# Altium schematic sheet Battery_management_system.schdoc
size A4; Organization: UFSC; DocumentNumber: 3; SheetNumber: 3; SheetTotal: 3
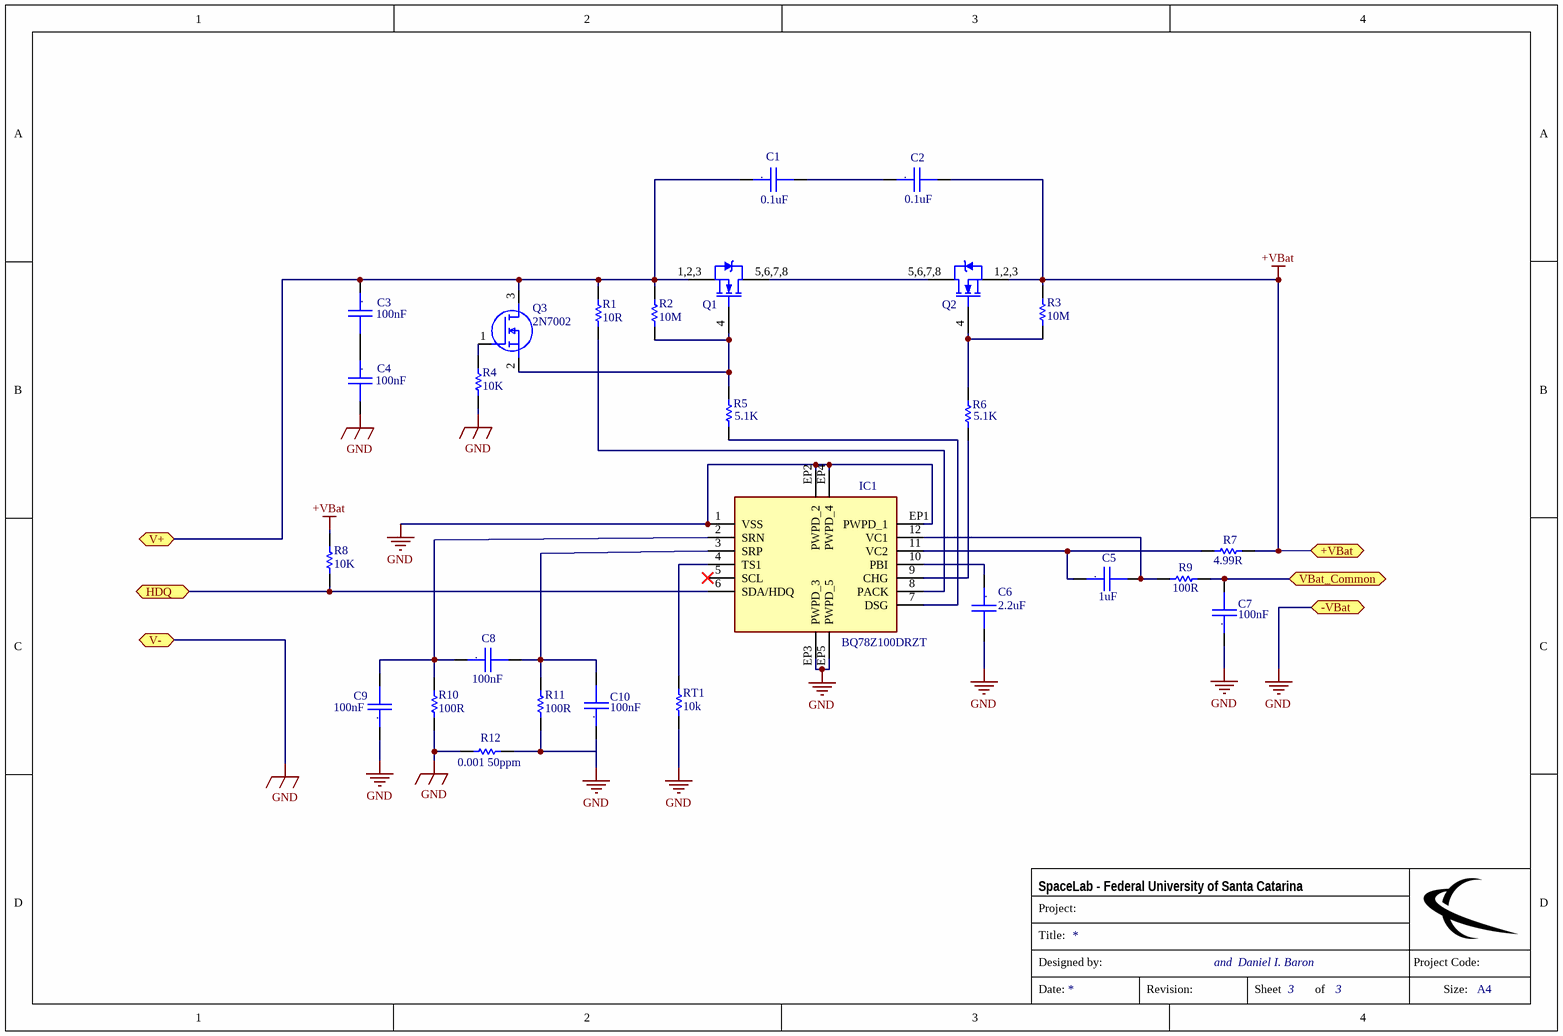
[diagram p0: Battery_management_system.schdoc]

## Parts
C1  0.1uF  [CC0603]
C2  0.1uF  [CC0603]
C3  Capacitance: 100nF  [CC0603]  (hidden comment: 0.1uF/50V)
C4  Capacitance: 100nF  [CC0603]  (hidden comment: 0.1uF/50V)
C5  Capacitance: 1uF  (hidden comment: CL10B105KO8VPNC)
C6  Capacitance: 2.2uF  [CC0603]  (hidden comment: CGA3E1X7S1C225K080AC)
C7  Capacitance: 100nF  [CC0603]  (hidden comment: CL10B104KO8WPNC)
C8  Capacitance: 100nF  [CC0603]  (hidden comment: CL10B104KO8WPNC)
C9  Capacitance: 100nF  [CC0603]  (hidden comment: CL10B104KO8WPNC)
C10  Capacitance: 100nF  [CC0603]  (hidden comment: CL10B104KO8WPNC)
IC1  BQ78Z100DRZT  [BQ78Z100DRZT]
Q1  CSD16412Q5A  [Q5A]  (value not drawn)
Q2  CSD16412Q5A  [Q5A]  (value not drawn)
Q3  2N7002  [SOT96P240X120-3N]
R1  Resistance: 10R  [0603]  (hidden comment: CRCW060310R0FKEA)
R2  value 10M  [0603]  (hidden comment: MCT06030C1005FP500)
R3  value 10M  [0603]  (hidden comment: MCT06030C1005FP500)
R4  value 10K  [0603]  (hidden comment: MCT0603MC1002FP50)
R5  value 5.1K  [0603]  (hidden comment: MCT06030C5101FP500)
R6  value 5.1K  [0603]  (hidden comment: MCT06030C5101FP500)
R7  Resistance: 4.99R  [0603]  (hidden comment: CRCW04024R99FKED)
R8  value 10K  [0603]  (hidden comment: MCT0603MC1002FP50)
R9  value 100R  [0603]  (hidden comment: MCT06030C1000FP500)
R10  value 100R  [0603]  (hidden comment: MCT06030C1000FP500)
R11  value 100R  [0603]  (hidden comment: MCT06030C1000FP500)
R12  value 0.001 50ppm  (hidden comment: CSNL1206FT1L00)
RT1  10k  [SEMI-103AT-2_V]

## Ports
+VBat (bidir), -VBat (bidir), HDQ (bidir), V+ (bidir), V- (bidir), VBat_Common (bidir)

## Nets
+VBat: C2.2 Q2.1,2,3(S) R3.2 R7.2 R8.2 ; port +VBat
GND: C4.2 C6.2 C7.1 C9.1 C10.1 IC1.1(VSS) IC1.EP1(PWPD_1) IC1.EP2(PWPD_2) IC1.EP3(PWPD_3) IC1.EP4(PWPD_4) IC1.EP5(PWPD_5) R4.1 R10.1 R11.1 R12.1 R12.2 RT1.1 ; port -VBat, port V-
HDQ: IC1.6(SDA/HDQ) R8.1 ; port HDQ
V+: C1.1 C3.1 Q1.1,2,3(S) Q3.3(D) R1.1 R2.2 ; port V+
VBat_Common: C7.2 R9.1 ; port VBat_Common
NetC1_2: C1.2 C2.1
NetC3_2: C3.2 C4.1
NetC5_1: C5.1 IC1.11(VC2) R7.1
NetC5_2: C5.2 IC1.12(VC1) R9.2
NetC6_1: C6.1 IC1.10(PBI)
NetC8_1: C8.1 C9.2 IC1.2(SRN) R10.2
NetC8_2: C8.2 C10.2 IC1.3(SRP) R11.2
NetIC1_4: IC1.4(TS1) RT1.2
NetIC1_7: IC1.7(DSG) R5.1
NetIC1_8: IC1.8(PACK) R1.2
NetIC1_9: IC1.9(CHG) R6.1
NetQ1_4: Q1.4(G) Q3.2(S) R2.1 R5.2
NetQ1_5,6,7,8: Q1.5,6,7,8(D) Q2.5,6,7,8(D)
NetQ2_4: Q2.4(G) R3.1 R6.2
NetQ3_1: Q3.1(G) R4.2

Not connected (* = marked no-connect by the designer): IC1 5(SCL)*

## Notes on the sheet
- and  Daniel I. Baron
- Project:
- SpaceLab - Federal University of Santa Catarina
- Title:
- Designed by:
- Project Code:
- Date:
- Revision:
- Sheet
- of
- Size:
- A4
- (in symbol Cap_Cer_X7R_0.1uF_50V_0603) .
- (in symbol CGA3E1X7S1C225K080AC) .
- (in symbol CL10B104KO8WPNC) .
- (in symbol CL10B105KO8VPNC) .

## Library data of the parts
C1 C2 = Cap_Cer_X7R_0.1uF_50V_0603: CAP CER 0.1UF 50V 10% X7R 0603; Partnumber: CC0603KPX7R9BB104; Manufacturer: Yageo; Capacitance: 100nF; Supplier 1: Mouser; Supplier Part Number 1: 603-CC603KPX7R9BB104; Stock 1: 5712768; Pricing 1: 1=0.1, 10=0.065, 100=0.02, 1000=0.016, 2500=0.013, 10000=0.01 (USD); Mount: Surface Mount; Case/Package: 0603; Number of Pins: 2; Weight: 7.1E-05oz; Case Code (Imperial): 0603; Case Code (Metric): 1608; Min Operating Temperature: -55°C; Max Operating Temperature: 125°C; Tolerance: 10%; Dielectric: X7R; Packaging: Tape and Reel; Voltage Rating (DC): 50V; Voltage Rating: 50V; Termination: SMD/SMT; Composition: Ceramic; Length: 1.6mm; Height: 0.8mm; Width: 0.031inch; Thickness: 0.035inch; Depth: 0.8mm; Radiation Hardening: No; Lead Free: Lead Free; Halogen Free: Halogen Free; ComponentLink1URL: https://www.verical.com/server-webapp/html/getDatasheet?partID=653026&src-supplier=Verical; ComponentLink1Description: https://www.verical.com/server-webapp/html/getDatasheet?partID=653026&src-supplier=Verical; Supplier 2: Digi-Key; Supplier Part Number 2: 311-3567-1-ND; Stock 2: 0; Pricing 2: 1=0.1, 10=0.066, 50=0.036, 100=0.0293, 500=0.02094, 1000=0.01646, 2500=0.01496, 5000=0.01376 (USD); Manufacturer Part Number: CC0603KPX7R9BB104
C3 C4 = Cap_Cer_X7R_0.1uF_50V_0603: CAP CER 0.1UF 50V 10% X7R 0603; Partnumber: CC0603KPX7R9BB104; Manufacturer: Yageo; Supplier 1: Mouser; Supplier Part Number 1: 603-CC603KPX7R9BB104; Stock 1: 5712768; Pricing 1: 1=0.1, 10=0.065, 100=0.02, 1000=0.016, 2500=0.013, 10000=0.01 (USD); Mount: Surface Mount; Case/Package: 0603; Number of Pins: 2; Weight: 7.1E-05oz; Case Code (Imperial): 0603; Case Code (Metric): 1608; Min Operating Temperature: -55°C; Max Operating Temperature: 125°C; Tolerance: 10%; Dielectric: X7R; Packaging: Tape and Reel; Voltage Rating (DC): 50V; Voltage Rating: 50V; Termination: SMD/SMT; Composition: Ceramic; Length: 1.6mm; Height: 0.8mm; Width: 0.031inch; Thickness: 0.035inch; Depth: 0.8mm; Radiation Hardening: No; Lead Free: Lead Free; Halogen Free: Halogen Free; ComponentLink1URL: https://www.verical.com/server-webapp/html/getDatasheet?partID=653026&src-supplier=Verical; ComponentLink1Description: https://www.verical.com/server-webapp/html/getDatasheet?partID=653026&src-supplier=Verical; Supplier 2: Digi-Key; Supplier Part Number 2: 311-3567-1-ND; Stock 2: 0; Pricing 2: 1=0.1, 10=0.066, 50=0.036, 100=0.0293, 500=0.02094, 1000=0.01646, 2500=0.01496, 5000=0.01376 (USD); Manufacturer Part Number: CC0603KPX7R9BB104
C5 = CL10B105KO8VPNC: SMD Multilayer Ceramic Capacitor,1uF, 16 V, 0603 [1608 Metric], 10%, X7R, CL Series; Manufacturer: Samsung; Description: SAMSUNG ELECTRO-MECHANICS - CL10B105KO8VPNC - SMD Multilayer Ceramic Capacitor, 1 &#181;F, 16 V, 0603 [1608 Metric], &#177; 10%, X7R, CL Series; Voltage Rating: 16V; Supplier 1: Digi-Key; Manufacturer Part Number: CL10B105KO8VPNC; RoHS: Yes; Category: Ceramic Capacitors; Stock 1: 897530; Pricing 1: 1=0,18000, 10=0,12900, 50=0,07340, 100=0,06080, 500=0,04260, 1000=0,03527 (USD); Mount: Surface Mount; Case/Package: 0603; Case Code (Metric): 1608; Case Code (Imperial): 0603; Min Operating Temperature: -55°C; Max Operating Temperature: 125°C; Tolerance: 10%; Packaging: Tape and Reel; Dielectric: X7R; Features: Soft Termination; Length: 0.063inch; Width: 0.031inch; Thickness: 0.035inch; Depth: 0.8mm; Ratings: AEC-Q200; Lead Free: Lead Free; RoHS Compliant: Yes; ComponentLink1URL: http://www.farnell.com/datasheets/2710686.pdf?src-supplier=Farnell; ComponentLink1Description: http://www.farnell.com/datasheets/2710686.pdf?src-supplier=Farnell; ComponentLink2URL: http://www.samsungsem.com/servlet/FileDownload?type=spec&file=CL10B105KO8VPNC.pdf&src-supplier=Avnet; ComponentLink2Description: http://www.samsungsem.com/servlet/FileDownload?type=spec&file=CL10B105KO8VPNC.pdf&src-supplier=Avnet; ComponentLink3URL: http://www.samsungsem.com/kr/support/product-search/mlcc/CL10B105KO8VPNC.jsp?src-supplier=Digi-Key; ComponentLink3Description: http://www.samsungsem.com/kr/support/product-search/mlcc/CL10B105KO8VPNC.jsp?src-supplier=Digi-Key; ComponentLink4URL: http://www.farnell.com/datasheets/2710686.pdf?src-supplier=Newark; ComponentLink4Description: http://www.farnell.com/datasheets/2710686.pdf?src-supplier=Newark; ComponentLink5URL: http://www.farnell.com/datasheets/2710686.pdf?src-supplier=Element14; ComponentLink5Description: http://www.farnell.com/datasheets/2710686.pdf?src-supplier=Element14; ComponentLink6URL: http://components.arrow.com/part/dataview/0323_06933310?src-supplier=Arrow+Europe; ComponentLink6Description: http://components.arrow.com/part/dataview/0323_06933310?src-supplier=Arrow+Europe; Supplier Part Number 1: 1276-6613-1-ND
C6 = CGA3E1X7S1C225K080AC: CAP CER 2.2UF 16V X7S 0603; Manufacturer: TDK; Tolerance: 10%; Supplier 1: Digi-Key; Manufacturer Part Number: CGA3E1X7S1C225K080AC; RoHS: Yes; Category: Ceramic Capacitors; Stock 1: 29; Pricing 1: 1=0,27000, 10=0,18500, 50=0,12320, 100=0,10470, 500=0,07392, 1000=0,06468 (USD); Mount: Surface Mount; Case/Package: 0603; Case Code (Metric): 1608; Case Code (Imperial): 0603; Min Operating Temperature: -55°C; Max Operating Temperature: 125°C; Package Quantity: 1; Packaging: Cut Tape; Voltage Rating: 16V; Dielectric: X7S; Voltage Rating (DC): 16V; Length: 0.063inch; Width: 0.031inch; Thickness: 0.035inch; Ratings: AEC-Q200; REACH SVHC: No SVHC; Lead Free: Lead Free; RoHS Compliant: Yes; ComponentLink1URL: http://www.farnell.com/datasheets/2292075.pdf?src-supplier=Farnell; ComponentLink1Description: http://www.farnell.com/datasheets/2292075.pdf?src-supplier=Farnell; ComponentLink2URL: https://product.tdk.com/info/en/catalog/spec/mlccspec_automotive_general_midvoltage_en.pdf?src-supplier=Digi-Key; ComponentLink2Description: https://product.tdk.com/info/en/catalog/spec/mlccspec_automotive_general_midvoltage_en.pdf?src-supplier=Digi-Key; ComponentLink3URL: http://www.farnell.com/datasheets/1936565.pdf?src-supplier=Element14; ComponentLink3Description: http://www.farnell.com/datasheets/1936565.pdf?src-supplier=Element14; ComponentLink4URL: https://product.tdk.com/info/en/catalog/datasheets/mlcc_automotive_general_en.pdf?src-supplier=Digi-Key; ComponentLink4Description: https://product.tdk.com/info/en/catalog/datasheets/mlcc_automotive_general_en.pdf?src-supplier=Digi-Key; ComponentLink5URL: http://product.tdk.com/en/catalog/datasheets/mlcc_automotive_general_en.pdf?src-supplier=Avnet; ComponentLink5Description: http://product.tdk.com/en/catalog/datasheets/mlcc_automotive_general_en.pdf?src-supplier=Avnet; ComponentLink6URL: http://www.farnell.com/datasheets/2292075.pdf?src-supplier=Newark; ComponentLink6Description: http://www.farnell.com/datasheets/2292075.pdf?src-supplier=Newark; Supplier Part Number 1: 445-16104-1-ND
C7-C10 = CL10B104KO8WPNC: CAP CER 0.1UF 16V X7R 0603; Manufacturer: Samsung; Tolerance: 10%; Supplier 1: Digi-Key; Supplier Part Number 1: 1276-6582-1-ND; Manufacturer Part Number: CL10B104KO8WPNC; RoHS: No; Category: Ceramic Capacitors; Stock 1: 515701; Pricing 1: 1=0,10000, 10=0,04200, 50=0,02280, 100=0,01860, 500=0,01328, 1000=0,01044 (USD); Mount: Surface Mount; Case/Package: 0603; Case Code (Imperial): 0603; Case Code (Metric): 1608; Min Operating Temperature: -55°C; Max Operating Temperature: 125°C; Packaging: Tape and Reel; Voltage Rating: 16V; Features: Soft Termination; Length: 0.063inch; Width: 0.031inch; Thickness: 0.035inch; Ratings: AEC-Q200; ComponentLink1URL: http://www.samsungsem.com/servlet/FileDownload?filename=productcatalog/pdf/MLCC.pdf&src-supplier=Avnet; ComponentLink1Description: http://www.samsungsem.com/servlet/FileDownload?filename=productcatalog/pdf/MLCC.pdf&src-supplier=Avnet; ComponentLink2URL: http://www.samsungsem.com/kr/support/product-search/mlcc/CL10B104KO8WPNC.jsp?src-supplier=Digi-Key; ComponentLink2Description: http://www.samsungsem.com/kr/support/product-search/mlcc/CL10B104KO8WPNC.jsp?src-supplier=Digi-Key
IC1 = BQ78Z100DRZT: Integrated Circuit; Manufacturer_Name: Texas Instruments; Datasheet Link: http://www.ti.com/lit/gpn/BQ78Z100; Height: 0.9mm; Manufacturer_Part_Number: BQ78Z100DRZT; Mouser Part Number: 595-BQ78Z100DRZT; Mouser Price/Stock: https://www.mouser.co.uk/ProductDetail/Texas-Instruments/BQ78Z100DRZT?qs=OjC2D0sG%2F26pqtddZWniKw%3D%3D; Arrow Part Number: BQ78Z100DRZT; Arrow Price/Stock: https://www.arrow.com/en/products/bq78z100drzt/texas-instruments; Supplier 1: Digi-Key; Supplier Part Number 1: 296-42996-1-ND
Q1 Q2 = CSD16412Q5A: Trans MOSFET N-CH 25V 14A 8-Pin SON EP T/R; Manufacturer: Texas Instruments; Max Power Dissipation: 3W; Element Configuration: Single; Rds On Max: 11mR; Input Capacitance: 530pF; Rise Time: 7.1ns; Continuous Drain Current (ID): 52A; Fall Time: 3.3ns; Drain to Source Resistance: 9mR; Turn-Off Delay Time: 5.7ns; Gate to Source Voltage (Vgs): 16V; Turn-On Delay Time: 5.5ns; Number of Elements: 1; Polarity: N-CHANNEL; Nominal Vgs: 2V; Supplier 1: Digi-Key; Manufacturer Part Number: CSD16412Q5A; RoHS: Yes; Category: MOSFETs; Stock 1: 1817; Pricing 1: 1=1,00000, 10=0,86500, 25=0,82520, 100=0,59900, 500=0,50046, 1000=0,42592 (USD); Mount: Surface Mount; Case/Package: SON; Number of Pins: 8; Contact Plating: Tin,Matte; Min Operating Temperature: -55°C; Max Operating Temperature: 150°C; Package Quantity: 1; Packaging: Tape and Reel; Series: NexFET™; Power Dissipation: 3W; Drain to Source Voltage (Vdss): 25V; Drain to Source Breakdown Voltage: 25V; Dual Supply Voltage: 25V; Threshold Voltage: 2V; Termination: SMD/SMT; Length: 5.8mm; Width: 5mm; Height: 1.1mm; Radiation Hardening: No; RoHS Compliant: Yes; REACH SVHC: No SVHC; Lead Free: Contains Lead; ComponentLink1URL: https://datasheet.ciiva.com/6387/csd16412q5a-6387536.pdf?src-supplier=Digi-Key; ComponentLink1Description: https://datasheet.ciiva.com/6387/csd16412q5a-6387536.pdf?src-supplier=Digi-Key; ComponentLink2URL: https://datasheet.ciiva.com/14423/slps207a-14423489.pdf?src-supplier=Avnet; ComponentLink2Description: https://datasheet.ciiva.com/14423/slps207a-14423489.pdf?src-supplier=Avnet; ComponentLink3URL: https://datasheet.ciiva.com/1255/csd16412q5a-1255298.pdf?src-supplier=Newark; ComponentLink3Description: https://datasheet.ciiva.com/1255/csd16412q5a-1255298.pdf?src-supplier=Newark; ComponentLink4URL: https://datasheet.ciiva.com/4438/slps207a-122183-4438713.pdf?src-supplier=Mouser; ComponentLink4Description: https://datasheet.ciiva.com/4438/slps207a-122183-4438713.pdf?src-supplier=Mouser; ComponentLink5URL: https://datasheet.ciiva.com/5751/483980-5751769.pdf?src-supplier=Farnell; ComponentLink5Description: https://datasheet.ciiva.com/5751/483980-5751769.pdf?src-supplier=Farnell; ComponentLink6URL: https://datasheet.ciiva.com/6387/csd16412q5a-6387530.pdf?src-supplier=Digi-Key; ComponentLink6Description: https://datasheet.ciiva.com/6387/csd16412q5a-6387530.pdf?src-supplier=Digi-Key; ComponentLink7URL: https://datasheet.ciiva.com/14192/slps207a-14192890.pdf?src-supplier=Avnet; ComponentLink7Description: https://datasheet.ciiva.com/14192/slps207a-14192890.pdf?src-supplier=Avnet; ComponentLink8URL: https://datasheet.ciiva.com/6387/csd16412q5a-6387532.pdf?src-supplier=Digi-Key; ComponentLink8Description: https://datasheet.ciiva.com/6387/csd16412q5a-6387532.pdf?src-supplier=Digi-Key; Supplier Part Number 1: 296-24256-1-ND
Q3 = 2N7002: MOSFET (N-Channel); Manufacturer_Name: Vishay; Datasheet Link: https://www.diodes.com/assets/Datasheets/ds11303.pdf; Height: 1.2mm; Manufacturer_Part_Number: 2N7002; Mouser Part Number: 781-2N7002; Mouser Price/Stock: https://www.mouser.co.uk/ProductDetail/Vishay-Siliconix/2N7002?qs=xBpwZ0JX2zKeuvZKtdYLZQ%3D%3D
R1 = CRCW060310R0FKEA: Res Thick Film 0603 10 Ohm 1% 1/10W ±100ppm/°C Molded SMD Paper T/R; Manufacturer: Vishay; Power Rating: 100mW; Voltage Rating: 75V; Supplier 1: Digi-Key; Manufacturer Part Number: CRCW060310R0FKEA; RoHS: Yes; Category: Chip SMD Resistors; Stock 1: 168376; Pricing 1: 1=0,10000, 10=0,03400, 100=0,01390, 1000=0,00624, 2500=0,00542 (USD); Mount: Surface Mount; Case/Package: 0603; Number of Pins: 2; Contact Plating: Tin; Weight: 7.1E-05oz; Case Code (Metric): 1608; Case Code (Imperial): 0603; Size Code: 0603; Min Operating Temperature: -55°C; Max Operating Temperature: 155°C; Tolerance: 1%; Resistor Type: Thick Film; Temperature Coefficient: 100ppm/°C; Packaging: Tape and Reel; Package Quantity: 10; Number of Terminations: 2; Termination: SMD/SMT; Max Power Dissipation: 100mW; Voltage Rating (DC): 75V; Features: Automotive AEC-Q200; Series: CRCW; Construction: Rectangular; Resistance Tolerance: 1%; Technology: THICK FILM; Length: 1.55mm; Width: 0.033inch; Height: 0.45mm; Depth: 0.85mm; Lead Free: Lead Free; RoHS Compliant: Yes; REACH SVHC: Unknown; Military Standard: Not; ComponentLink1URL: https://datasheet.ciiva.com/11808/0900766b80d98afc-11808660.pdf?src-supplier=RSComponents; ComponentLink1Description: https://datasheet.ciiva.com/11808/0900766b80d98afc-11808660.pdf?src-supplier=RSComponents; ComponentLink2URL: https://datasheet.ciiva.com/2465/dcrcwe3-2465699.pdf?src-supplier=Digi-Key; ComponentLink2Description: https://datasheet.ciiva.com/2465/dcrcwe3-2465699.pdf?src-supplier=Digi-Key; ComponentLink3URL: https://datasheet.ciiva.com/2465/dcrcwe3-2465700.pdf?src-supplier=Digi-Key; ComponentLink3Description: https://datasheet.ciiva.com/2465/dcrcwe3-2465700.pdf?src-supplier=Digi-Key; ComponentLink4URL: https://datasheet.ciiva.com/16740/dcrcwe3-16740661.pdf?src-supplier=Future+Electronics; ComponentLink4Description: https://datasheet.ciiva.com/16740/dcrcwe3-16740661.pdf?src-supplier=Future+Electronics; ComponentLink5URL: https://datasheet.ciiva.com/26316/fld-crcw-e3-data-en-26316582.pdf?src-supplier=Distrelec; ComponentLink5Description: https://datasheet.ciiva.com/26316/fld-crcw-e3-data-en-26316582.pdf?src-supplier=Distrelec; ComponentLink6URL: https://datasheet.ciiva.com/3256/dcrcwe3-3256955.pdf?src-supplier=Avnet; ComponentLink6Description: https://datasheet.ciiva.com/3256/dcrcwe3-3256955.pdf?src-supplier=Avnet; ComponentLink7URL: https://datasheet.ciiva.com/5547/dcrcwe3-109170-5547342.pdf?src-supplier=Mouser; ComponentLink7Description: https://datasheet.ciiva.com/5547/dcrcwe3-109170-5547342.pdf?src-supplier=Mouser; ComponentLink8URL: https://datasheet.ciiva.com/22673/1697337-22673071.pdf?src-supplier=Element14; ComponentLink8Description: https://datasheet.ciiva.com/22673/1697337-22673071.pdf?src-supplier=Element14; ComponentLink9URL: https://datasheet.ciiva.com/16781/70201119-16781847.pdf?src-supplier=Allied+Electronics; ComponentLink9Description: https://datasheet.ciiva.com/16781/70201119-16781847.pdf?src-supplier=Allied+Electronics; ComponentLink10URL: https://datasheet.ciiva.com/2465/dcrcwe3-2465701.pdf?src-supplier=Digi-Key; ComponentLink10Description: https://datasheet.ciiva.com/2465/dcrcwe3-2465701.pdf?src-supplier=Digi-Key; Supplier Part Number 1: 541-10.0HCT-ND
R2 R3 = MCT06030C1005FP500: Resistor 10M; Manufacturer_Name: Vishay; Datasheet Link: http://www.vishay.com/docs/28705/mcx0x0xpro.pdf; Height: 0.55mm; Manufacturer_Part_Number: MCT06030C1005FP500; Mouser Part Number: 594-MCT06030C1005FP5; Mouser Price/Stock: https://www.mouser.co.uk/ProductDetail/Vishay-Beyschlag/MCT06030C1005FP500?qs=Sk19l0%2FxcWkhTReAJ%2FgU6w%3D%3D; Arrow Part Number: MCT06030C1005FP500; Arrow Price/Stock: https://www.arrow.com/en/products/mct06030c1005fp500/vishay; Supplier 1: Digi-Key; Supplier Part Number 1: MCT0603-10.0M-CFCT-ND
R4 R8 = MCT0603MC1002FP50: Resistor 10k; Supplier 1: Digi-Key; Supplier Part Number 1: MCT0603-10.0K-MFCT-ND
R5 R6 = MCT06030C5101FP500: Resistor 5.1k; Manufacturer_Name: Vishay; Datasheet Link: http://www.vishay.com/docs/28705/mcx0x0xpro.pdf; Height: 0.55mm; Manufacturer_Part_Number: MCT06030C5101FP500; Supplier 1: Digi-Key; Supplier Part Number 1: 749-1663-1-ND
R7 = CRCW04024R99FKED: RESISTOR, THICK FILM, 4.99OHM, 100mW, 1%; Manufacturer: Vishay Dale; Manufacturer Part Number: CRCW06034R99FNEA; Voltage Rating: 75V; Temperature Coefficient: 200ppm/°C; Supplier 1: Digi-Key; RoHS: Yes; Category: Chip SMD Resistors; Stock 1: 31663; Pricing 1: 1=0,10000, 10=0,05800, 100=0,02340, 1000=0,01051, 2500=0,00912 (USD); Case/Package: 0603; Number of Pins: 2; Weight: 7.1E-05oz; Case Code (Imperial): 0603; Case Code (Metric): 1608; Contact Plating: Tin; Min Operating Temperature: -55°C; Max Operating Temperature: 155°C; Tolerance: 1%; Power Rating: 100mW; Packaging: Tape and Reel; Termination: SMD/SMT; Package Quantity: 10; Resistor Type: Thick Film; Number of Terminations: 2; Max Power Dissipation: 100mW; Voltage Rating (DC): 75V; Features: Automotive AEC-Q200; Series: CRCW; Technology: THICK FILM; Resistance Tolerance: 1%; Length: 0.061inch; Width: 0.85mm; Height: 0.45mm; Depth: 0.85mm; REACH SVHC: Unknown; Lead Free: Lead Free; RoHS Compliant: Yes; ComponentLink1URL: https://datasheet.ciiva.com/2562/dcrcwe3-2562730.pdf?src-supplier=Digi-Key; ComponentLink1Description: https://datasheet.ciiva.com/2562/dcrcwe3-2562730.pdf?src-supplier=Digi-Key; ComponentLink2URL: https://datasheet.ciiva.com/2562/dcrcwe3-2562731.pdf?src-supplier=Digi-Key; ComponentLink2Description: https://datasheet.ciiva.com/2562/dcrcwe3-2562731.pdf?src-supplier=Digi-Key; ComponentLink3URL: https://datasheet.ciiva.com/2562/dcrcwe3-2562732.pdf?src-supplier=Digi-Key; ComponentLink3Description: https://datasheet.ciiva.com/2562/dcrcwe3-2562732.pdf?src-supplier=Digi-Key; ComponentLink4URL: https://datasheet.ciiva.com/6195/125364-6195084.pdf?src-supplier=Farnell; ComponentLink4Description: https://datasheet.ciiva.com/6195/125364-6195084.pdf?src-supplier=Farnell; ComponentLink5URL: https://datasheet.ciiva.com/16758/70201119-16758280.pdf?src-supplier=Allied+Electronics; ComponentLink5Description: https://datasheet.ciiva.com/16758/70201119-16758280.pdf?src-supplier=Allied+Electronics; ComponentLink6URL: https://datasheet.ciiva.com/7792/125364-7792319.pdf?src-supplier=Element14; ComponentLink6Description: https://datasheet.ciiva.com/7792/125364-7792319.pdf?src-supplier=Element14; ComponentLink7URL: https://datasheet.ciiva.com/22872/70201119-22872167.pdf?src-supplier=Allied+Electronics; ComponentLink7Description: https://datasheet.ciiva.com/22872/70201119-22872167.pdf?src-supplier=Allied+Electronics; Supplier Part Number 1: 541-4.99HCT-ND
R9-R11 = MCT06030C1000FP500: Resistor 100ohm; Supplier 1: Digi-Key; Supplier Part Number 1: MCT0603-100-CFCT-ND
R12 = CSNL1206FT1L00: Res Metal Foil 1206 0.001 Ohm 1% 1W 50ppm/C Molded SMD SMD Plastic T/R; Manufacturer: Stackpole Electronics; Resistance: 1mR; Temperature Coefficient: 50ppm/°C; Supplier 1: Digi-Key; Manufacturer Part Number: CSNL1206FT1L00; RoHS: Yes; Category: Chip SMD Resistors; Stock 1: 119231; Pricing 1: 1=0,59000, 10=0,49000, 25=0,42000, 50=0,37800, 100=0,32900, 250=0,29400, 500=0,23800, 1000=0,19250 (USD); Mount: Surface Mount; Case/Package: 1206; Case Code (Metric): 3216; Case Code (Imperial): 1206; Contact Plating: Tin,Matte; Size Code: 1206; Min Operating Temperature: -55°C; Max Operating Temperature: 170°C; Tolerance: 1%; Packaging: Tape and Reel; Power Rating: 1W; Resistor Type: Metal Foil; Number of Terminations: 2; Max Power Dissipation: 1W; Features: Moisture Resistant; Series: CSNL; Length: 0.126inch; Width: 0.063inch; Height: 0.035inch; Radiation Hardening: No; Lead Free: Lead Free; RoHS Compliant: Yes; ComponentLink1URL: https://www.seielect.com/Catalog/SEI-csnl.pdf?src-supplier=Digi-Key; ComponentLink1Description: https://www.seielect.com/Catalog/SEI-csnl.pdf?src-supplier=Digi-Key; ComponentLink2URL: https://www.seielect.com/catalog/SEI-Packaging.pdf?src-supplier=Digi-Key; ComponentLink2Description: https://www.seielect.com/catalog/SEI-Packaging.pdf?src-supplier=Digi-Key; ComponentLink3URL: https://www.seielect.com/Catalog/SEI-CSNL.pdf?src-supplier=Avnet; ComponentLink3Description: https://www.seielect.com/Catalog/SEI-CSNL.pdf?src-supplier=Avnet; ComponentLink4URL: http://www.seielect.com/Catalog/SEI-CSNL.pdf?src-supplier=Future+Electronics; ComponentLink4Description: http://www.seielect.com/Catalog/SEI-CSNL.pdf?src-supplier=Future+Electronics; Supplier Part Number 1: CSNL1206FT1L00CT-ND
RT1 = CMP-2000-05824-1: Precision NTC Thermistor, 10 kOhm, +/- 1%, 10 mW, -50 to 110 degC, 2-Pin THD, RoHS, Bulk; Brand: Semitec; Resistance: 10kOhms; Packaging: Bulk; Mounting Technology: ThroughHole; Operating Temperature Range: -50Cto+110C; Lead Spacing: 2.54mm; RoHS: True; Manufacturer URL: http://www.semitec.co.jp/english/; Datasheet Version: Rev. A, 02/2007; Length: 17mm; Manufacturer: Semitec; Termination Style: Radial; Tolerance: 1%; Datasheet URL: https://www.rapidonline.com/pdf/61-0500e.pdf; Product Category: Thermistors-NTC; Series: AT; Package Description: 2-Pin Through Hole Device, Body Width 3.8 mm (Max), Pitch 2.54 mm; Width: 3.7mm; Type: NTC; Package Reference: 103AT-2; Height: 2.4mm